# EAGLE schematic 3DBoard (EAGLE 9.6.2)
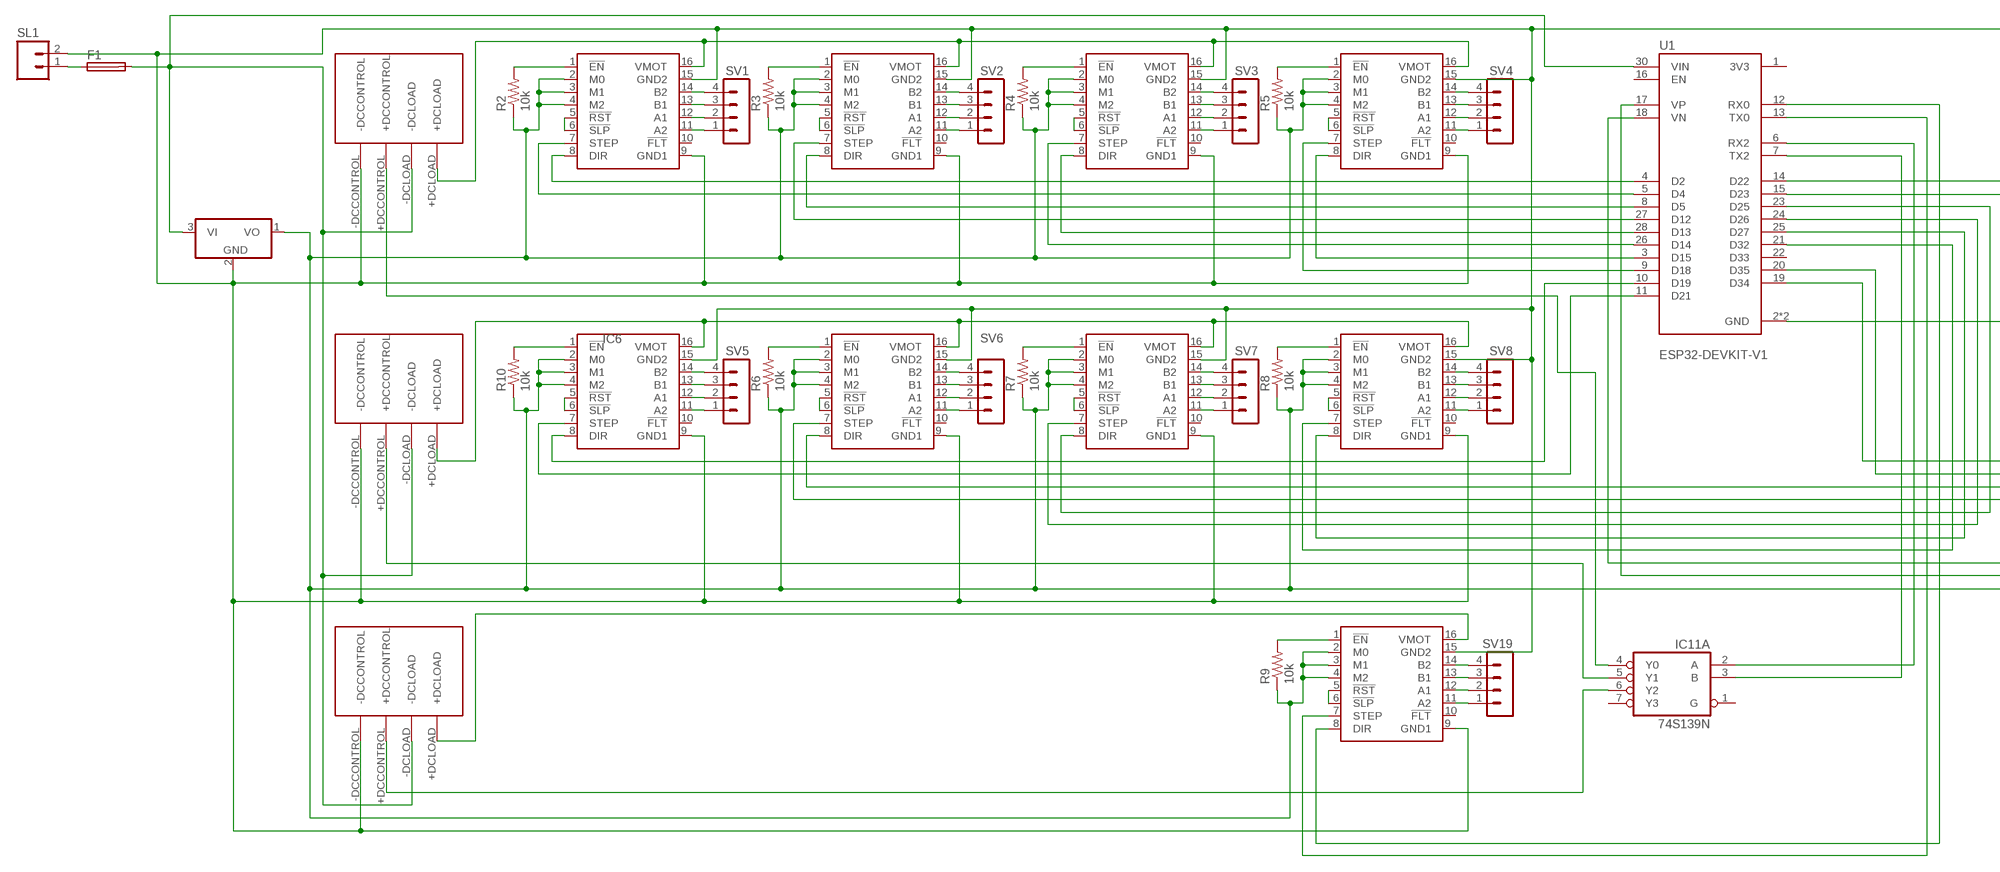
[diagram p0: schematic, sheet 1, part 1 of 2]
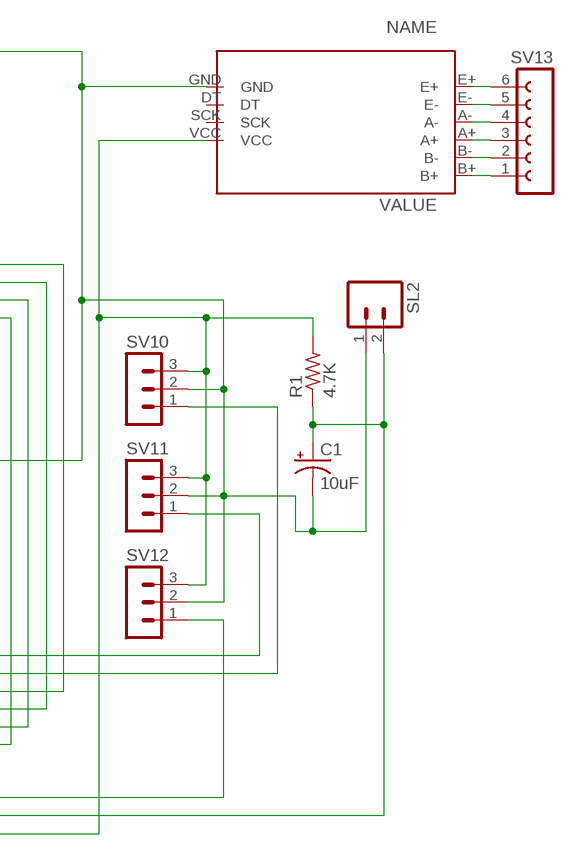
[diagram p1: schematic, sheet 1, part 2 of 2]

## Parts
C1  10uF  CPOL-USB45181B  [B45181B]
F1  GSH15  [GSH15]
IC1  78L05Z  [TO92]
IC2  2987-DRV8825  [DRV8825]
IC3  2987-DRV8825  [DRV8825]
IC4  2987-DRV8825  [DRV8825]
IC5  2987-DRV8825  [DRV8825]
IC6  2987-DRV8825  [DRV8825]
IC7  2987-DRV8825  [DRV8825]
IC8  2987-DRV8825  [DRV8825]
IC9  2987-DRV8825  [DRV8825]
IC10  2987-DRV8825  [DRV8825]
IC11  74S139N  [DIL16]
R1  4.7K  R-US_0204/7  [0204/7]
R2  10k  R-US_0204/7  [0204/7]
R3  10k  R-US_0204/7  [0204/7]
R4  10k  R-US_0204/7  [0204/7]
R5  10k  R-US_0204/7  [0204/7]
R6  10k  R-US_0204/7  [0204/7]
R7  10k  R-US_0204/7  [0204/7]
R8  10k  R-US_0204/7  [0204/7]
R9  10k  R-US_0204/7  [0204/7]
R10  10k  R-US_0204/7  [0204/7]
SL1  M02  [02P]
SL2  M02  [02P]
SV1  MA04-1  [MA04-1]
SV2  MA04-1  [MA04-1]
SV3  MA04-1  [MA04-1]
SV4  MA04-1  [MA04-1]
SV5  MA04-1  [MA04-1]
SV6  MA04-1  [MA04-1]
SV7  MA04-1  [MA04-1]
SV8  MA04-1  [MA04-1]
SV10  MA03-1  [MA03-1]
SV11  MA03-1  [MA03-1]
SV12  MA03-1  [MA03-1]
SV13  FE06-1  [FE06]
SV19  MA04-1  [MA04-1]
U1  ESP32-DEVKIT-V1  [MODULE_ESP32_DEVKIT_V1]
U$2  HX711A  [HX711]
U$3  CMX60D10  [SIP-4]
U$4  CMX60D10  [SIP-4]
U$5  CMX60D10  [SIP-4]

## Nets
N$1: IC2.8(DIR) U1.4(D2)
N$2: IC10.16(VMOT) U$5.+DCLOAD
N$3: IC6.16(VMOT) IC7.16(VMOT) IC8.16(VMOT) IC9.16(VMOT) U$4.+DCLOAD
N$4: IC2.16(VMOT) IC3.16(VMOT) IC4.16(VMOT) IC5.16(VMOT) U$3.+DCLOAD
N$5: IC5.11(A2) SV4.1
N$6: IC2.7(STEP) U1.5(D4)
N$7: IC5.12(A1) SV4.2
N$8: IC5.13(B1) SV4.3
N$9: IC5.14(B2) SV4.4
N$10: IC9.11(A2) SV8.1
N$11: IC9.12(A1) SV8.2
N$12: IC9.13(B1) SV8.3
N$13: IC9.14(B2) SV8.4
N$14: IC10.11(A2) SV19.1
N$15: IC10.12(A1) SV19.2
N$16: IC10.13(B1) SV19.3
N$17: IC10.14(B2) SV19.4
N$18: IC4.11(A2) SV3.1
N$19: IC4.12(A1) SV3.2
N$20: IC4.13(B1) SV3.3
N$21: IC4.14(B2) SV3.4
N$22: IC3.11(A2) SV2.1
N$23: IC3.12(A1) SV2.2
N$24: IC3.13(B1) SV2.3
N$25: IC3.14(B2) SV2.4
N$26: IC2.11(A2) SV1.1
N$27: IC2.12(A1) SV1.2
N$28: IC2.13(B1) SV1.3
N$29: IC2.14(B2) SV1.4
N$30: IC6.11(A2) SV5.1
N$31: IC6.12(A1) SV5.2
N$32: IC6.13(B1) SV5.3
N$33: IC6.14(B2) SV5.4
N$34: IC7.11(A2) SV6.1
N$35: IC7.12(A1) SV6.2
N$36: IC7.13(B1) SV6.3
N$37: SV13.1 U$2.B+
N$38: SV13.2 U$2.B-
N$39: SV13.3 U$2.A+
N$40: SV13.4 U$2.A-
N$41: SV13.5 U$2.E-
N$42: SV13.6 U$2.E+
N$43: C1.- IC1.2(GND) IC2.9(GND1) IC2.15(GND2) IC3.9(GND1) IC3.15(GND2) IC4.9(GND1) IC4.15(GND2) IC5.9(GND1) IC5.15(GND2) IC6.9(GND1) IC6.15(GND2) IC7.9(GND1) IC7.15(GND2) IC8.9(GND1) IC8.15(GND2) IC9.9(GND1) IC9.15(GND2) IC10.9(GND1) IC10.15(GND2) SL1.2 SL2.1 SV10.2 SV11.2 SV12.2 U1.2(GND) U1.29(GND) U$2.GND U$3.-DCCONTROL U$4.-DCCONTROL U$5.-DCCONTROL
N$44: IC7.14(B2) SV6.4
N$45: IC8.11(A2) SV7.1
N$46: F1.1 SL1.1
N$47: IC8.12(A1) SV7.2
N$49: IC8.13(B1) SV7.3
N$50: IC8.14(B2) SV7.4
N$53: IC3.8(DIR) U1.8(D5)
N$54: IC3.7(STEP) U1.27(D12)
N$55: IC4.8(DIR) U1.28(D13)
N$56: IC4.7(STEP) U1.26(D14)
N$57: IC5.8(DIR) U1.3(D15)
N$58: IC2.5(!RST) IC2.6(!SLP)
N$59: IC3.5(!RST) IC3.6(!SLP)
N$60: IC4.5(!RST) IC4.6(!SLP)
N$61: IC5.5(!RST) IC5.6(!SLP)
N$62: IC6.5(!RST) IC6.6(!SLP)
N$63: IC7.5(!RST) IC7.6(!SLP)
N$64: IC8.5(!RST) IC8.6(!SLP)
N$65: IC9.5(!RST) IC9.6(!SLP)
N$66: IC10.5(!RST) IC10.6(!SLP)
N$67: IC2.1(!EN) R2.2
N$68: IC3.1(!EN) R3.2
N$69: IC4.1(!EN) R4.2
N$70: IC5.1(!EN) R5.2
N$71: IC7.1(!EN) R6.2
N$72: IC8.1(!EN) R7.2
N$73: IC9.1(!EN) R8.2
N$74: IC10.1(!EN) R9.2
N$75: IC6.1(!EN) R10.2
N$76: IC5.7(STEP) U1.9(D18)
N$77: IC6.8(DIR) U1.10(D19)
N$78: F1.2 IC1.3(VI) U1.30(VIN) U$3.-DCLOAD U$4.-DCLOAD U$5.-DCLOAD
N$79: IC1.1(VO) IC2.2(M0) IC2.3(M1) IC2.4(M2) IC3.2(M0) IC3.3(M1) IC3.4(M2) IC4.2(M0) IC4.3(M1) IC4.4(M2) IC5.2(M0) IC5.3(M1) IC5.4(M2) IC6.2(M0) IC6.3(M1) IC6.4(M2) IC7.2(M0) IC7.3(M1) IC7.4(M2) IC8.2(M0) IC8.3(M1) IC8.4(M2) IC9.2(M0) IC9.3(M1) IC9.4(M2) IC10.2(M0) IC10.3(M1) IC10.4(M2) R1.2 R2.1 R3.1 R4.1 R5.1 R6.1 R7.1 R8.1 R9.1 R10.1 SV10.3 SV11.3 SV12.3 U$2.VCC
N$80: IC6.7(STEP) U1.11(D21)
N$81: IC7.8(DIR) U1.14(D22)
N$82: IC7.7(STEP) U1.15(D23)
N$83: IC8.8(DIR) U1.23(D25)
N$84: IC8.7(STEP) U1.24(D26)
N$85: IC9.8(DIR) U1.25(D27)
N$86: IC9.7(STEP) U1.21(D32)
N$87: IC11.6(A:Y2) U$5.+DCCONTROL
N$88: IC10.7(STEP) U1.13(TX0)
N$89: IC11.4(A:Y0) U$3.+DCCONTROL
N$90: IC11.5(A:Y1) U$4.+DCCONTROL
N$91: SV10.1 U1.20(D35)
N$92: SV11.1 U1.19(D34)
N$93: IC10.8(DIR) U1.12(RX0)
N$94: C1.+ R1.1 SL2.2 U1.17(VP)
N$95: IC11.2(A:A) U1.6(RX2)
N$96: IC11.3(A:B) U1.7(TX2)
N$97: SV12.1 U1.18(VN)
Unconnected: IC2.10(!FLT) IC3.10(!FLT) IC4.10(!FLT) IC5.10(!FLT) IC6.10(!FLT) IC7.10(!FLT) IC8.10(!FLT) IC9.10(!FLT) IC10.10(!FLT) IC11.1(A:G) IC11.7(A:Y3) IC11.9(B:Y3) IC11.10(B:Y2) IC11.11(B:Y1) IC11.12(B:Y0) IC11.13(B:B) IC11.14(B:A) IC11.15(B:G) U1.1(3V3) U1.16(EN) U1.22(D33) U$2.DT U$2.SCK

## Power pins joined to a net without a drawn wire
GND: IC11.8(P:GND)
VCC: IC11.16(P:VCC)

## Library data of the parts
C1 = rcl:CPOL-US: POLARIZED CAPACITOR, American symbol; SPICEPREFIX: C
F1 = fuse:GSH15: FUSE HOLDER grid 15mm, 19649 Wickmann; MPN: 64900001039; OC_FARNELL: 1271673; OC_NEWARK: 02P0318
IC1 = linear:78*: Positive VOLTAGE REGULATOR Source: http://cache.national.com/ds/LM/LM78L05.pdf http://www.fairchildsemi.com/ds/LM/LM7805.pdf
IC2-IC10 = pololu-stepper-driver:2987-DRV8825: DRV8825 Stepper Motor Driver Carrier; High Current (Bulk; Header Pins Soldered) #2987 DRV8825 Stepper Motor Driver Carrier; High Current (Bulk; Header Pins Soldered) <https://www.pololu.com/product/2987> in Japan, Suzaku Lab. Ltd. <https://suzakugiken.jp/> #2987 DRV8825 大電流ステッピングモータドライバボード (バルク品 ピンヘッダ実装済み) <https://szc.jp/po2987>
IC11 = 74xx-us:74*139: Dual 2-line to 4-line DECODER/DEMULTIPLEXER
R1-R10 = rcl:R-US_: RESISTOR, American symbol; SPICEPREFIX: R
SL1 SL2 = con-amp-quick:M02: AMP QUICK CONNECTOR; OC_FARNELL: unknown; OC_NEWARK: unknown
SV1-SV8 SV19 = con-lstb:MA04-1: PIN HEADER; OC_FARNELL: unknown; OC_NEWARK: unknown
SV10-SV12 = con-lstb:MA03-1: PIN HEADER; OC_FARNELL: unknown; OC_NEWARK: unknown
SV13 = con-lsta:FE06-1: FEMALE HEADER; OC_FARNELL: unknown; OC_NEWARK: unknown
U1 = ESP32-DEVKIT-V1:ESP32-DEVKIT-V1: Dual core, Wi-Fi: 2.4 GHz up to 150 Mbits/s,BLE (Bluetooth Low Energy) and legacy Bluetooth, 32 bits, Up to 240 MHz Check availability <https://pricing.snapeda.com/parts/ESP32-DEVKIT-V1/Do%20it/view-part?ref=eda>; AVAILABILITY: Not in stock; DESCRIPTION: Dual core, Wi-Fi: 2.4 GHz up to 150 Mbits/s,BLE (Bluetooth Low Energy) and legacy Bluetooth, 32 bits, Up to 240 MHz; MF: Do it; MP: ESP32-DEVKIT-V1; PACKAGE: None; PRICE: None
U$2 = HX711:HX711
U$3-U$5 = CMX60D10:CMX60D10: Relay; SSR; Gen Purp; SPST-NO; Cur-Rtg 10A; Ctrl-V 3-10DC; Vol-Rtg 0-60DC; PCB Mnt; UL Check availability <https://pricing.snapeda.com/parts/CMX60D10/Sensata-Crydom/view-part?ref=eda>; AVAILABILITY: In Stock; DESCRIPTION: Solid State SPST-NO (1 Form A) 4-SIP; MF: Sensata-Crydom; MP: CMX60D10; PACKAGE: SIP-4 Sensata; PRICE: None; PURCHASE-URL: https://pricing.snapeda.com/search/part/CMX60D10/?ref=eda